# Altium schematic sheet MOTOR_DRIVER1.SchDoc
size A4
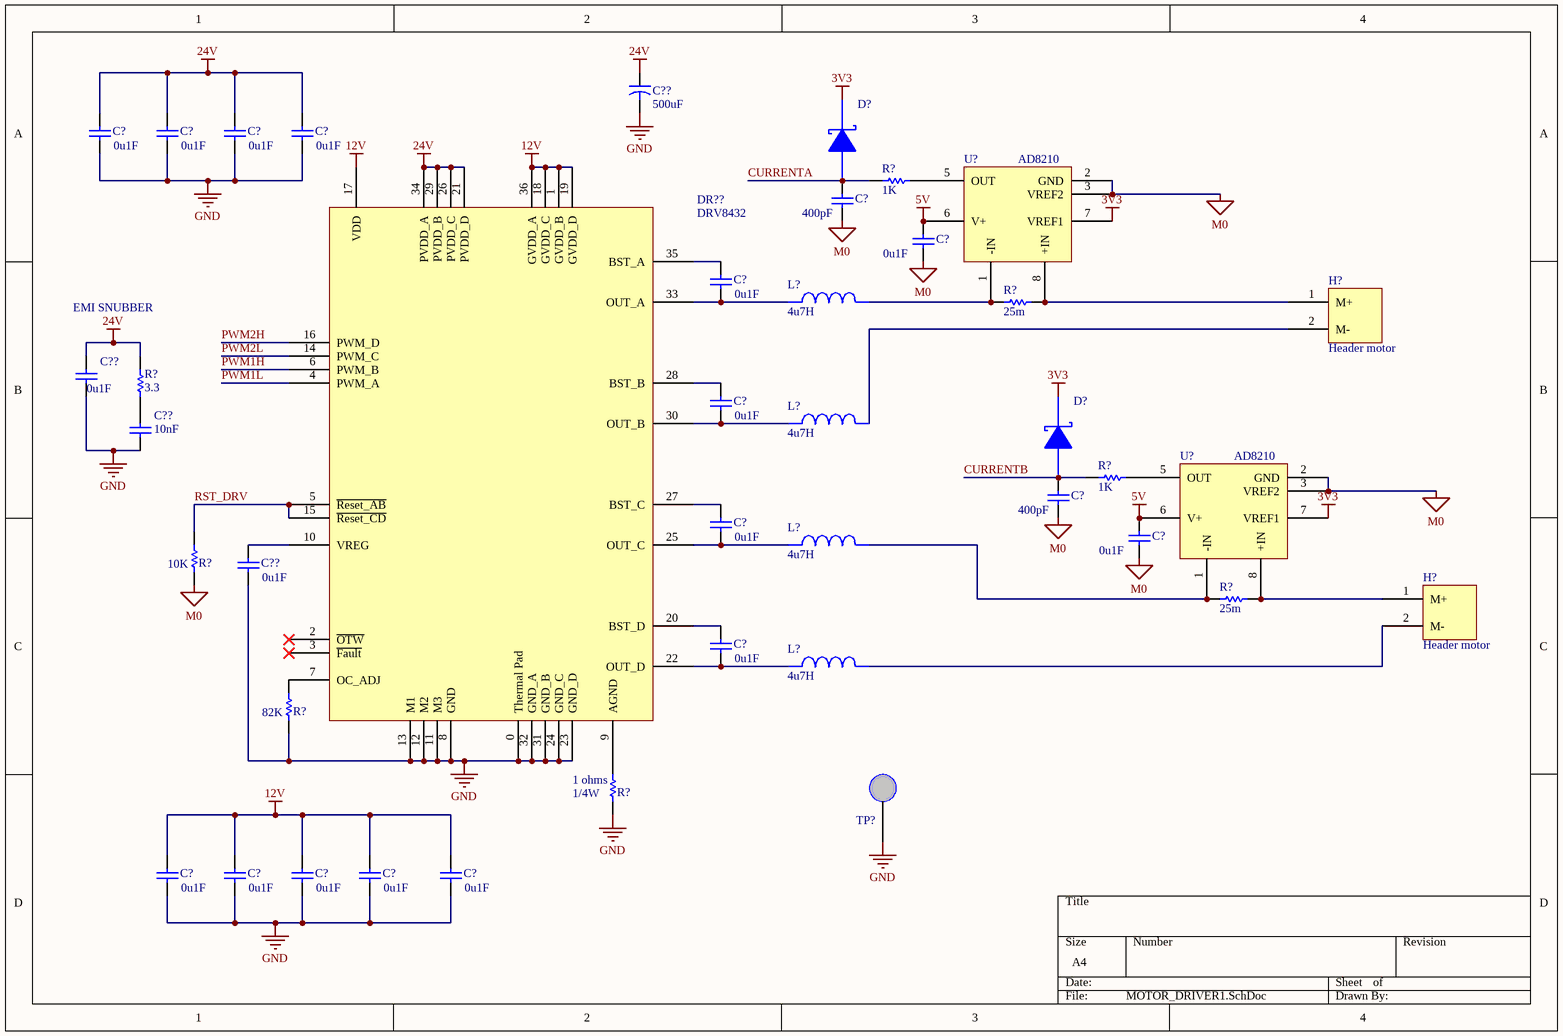
[diagram p0: MOTOR_DRIVER1.SchDoc]

## Parts
(Parts that share a designator on the sheet are numbered #1, #2 ... from top to bottom, then left to right.)
C?#1  value 0u1F  [0603]  (hidden comment: C0603)
C?#2  value 0u1F  [0603]  (hidden comment: C0603)
C?#3  value 0u1F  [0603]  (hidden comment: C0603)
C?#4  value 0u1F  [0603]  (hidden comment: C0603)
C?#5  value 400pF  [0603]  (hidden comment: C0603)
C?#6  value 0u1F  [0603]  (hidden comment: C0603)
C?#7  value 0u1F  [0603]  (hidden comment: C0603)
C?#8  value 0u1F  [0603]  (hidden comment: C0603)
C?#9  value 400pF  [0603]  (hidden comment: C0603)
C?#10  value 0u1F  [0603]  (hidden comment: C0603)
C?#11  value 0u1F  [0603]  (hidden comment: C0603)
C?#12  value 0u1F  [0603]  (hidden comment: C0603)
C?#13  value 0u1F  [0603]  (hidden comment: C0603)
C?#14  value 0u1F  [0603]  (hidden comment: C0603)
C?#15  value 0u1F  [0603]  (hidden comment: C0603)
C?#16  value 0u1F  [0603]  (hidden comment: C0603)
C?#17  value 0u1F  [0603]  (hidden comment: C0603)
C??#1  500uF
C??#2  value 0u1F  [C0805]  (hidden comment: C0805)
C??#3  value 10nF  [C0805]  (hidden comment: C0805)
C??#4  0u1F  [C0805]
D?#1  CRS08  (value not drawn)
D?#2  CRS08  (value not drawn)
DR??  DRV8432  [DRV8432]
H?#1  Header motor  [Header_motor_WEID]
H?#2  Header motor  [Header_motor_WEID]
L?#1  value 4u7H  (hidden comment: ChokeMotor)
L?#2  value 4u7H  (hidden comment: ChokeMotor)
L?#3  value 4u7H  (hidden comment: ChokeMotor)
L?#4  value 4u7H  (hidden comment: ChokeMotor)
R?#1  1K  [R0805]
R?#2  value 25m  [8RB-1206]  (hidden comment: 1206)
R?#3  value 3.3  [8RB-1206]  (hidden comment: 1206)
R?#4  1K  [R0805]
R?#5  10K  [R0805]
R?#6  value 25m  [8RB-1206]  (hidden comment: 1206)
R?#7  82K  [R0805]
R?#8  1 ohms  Power: 1/4W  [R0805]
TP?  5003K  [5003K]  (value not drawn)
U?#1  AD8210
U?#2  AD8210

## Nets
3V3: D?#1.2(A) D?#2.2(A) U?#1.7(VREF1) U?#2.7(VREF1)
5V: C?#6.2 C?#11.2 U?#1.6(V+) U?#2.6(V+)
12V: C?#13.2 C?#14.2 C?#15.2 C?#16.2 C?#17.2 DR??.1(GVDD_B) DR??.17(VDD) DR??.18(GVDD_C) DR??.19(GVDD_D) DR??.36(GVDD_A)
24V: C?#1.2 C?#2.2 C?#3.2 C?#4.2 C??#1.1 C??#2.2 DR??.21(PVDD_D) DR??.26(PVDD_C) DR??.29(PVDD_B) DR??.34(PVDD_A) R?#3.1
GND: C?#1.1 C?#2.1 C?#3.1 C?#4.1 C?#13.1 C?#14.1 C?#15.1 C?#16.1 C?#17.1 C??#1.2 C??#2.1 C??#3.1 C??#4.1 DR??.0(Thermal_Pad) DR??.8(GND) DR??.11(M3) DR??.12(M2) DR??.13(M1) DR??.23(GND_D) DR??.24(GND_C) DR??.31(GND_B) DR??.32(GND_A) R?#7.1 R?#8.1 TP?.1
M0: C?#5.1 C?#6.1 C?#9.1 C?#11.1 R?#5.1 U?#1.2(GND) U?#1.3(VREF2) U?#2.2(GND) U?#2.3(VREF2)
CURRENTA: C?#5.2 D?#1.1(K) R?#1.2
CURRENTB: C?#9.2 D?#2.1(K) R?#4.2
PWM1H: DR??.6(PWM_B)
PWM1L: DR??.4(PWM_A)
PWM2H: DR??.16(PWM_D)
PWM2L: DR??.14(PWM_C)
RST_DRV: DR??.5(~{Reset_AB}) DR??.15(~{Reset_CD}) R?#5.2
NetC?#7_1: C?#7.1 DR??.33(OUT_A) L?#1.2
NetC?#7_2: C?#7.2 DR??.35(BST_A)
NetC?#8_1: C?#8.1 DR??.30(OUT_B) L?#2.2
NetC?#8_2: C?#8.2 DR??.28(BST_B)
NetC?#10_1: C?#10.1 DR??.25(OUT_C) L?#3.2
NetC?#10_2: C?#10.2 DR??.27(BST_C)
NetC?#12_1: C?#12.1 DR??.22(OUT_D) L?#4.2
NetC?#12_2: C?#12.2 DR??.20(BST_D)
NetC??#3_2: C??#3.2 R?#3.2
NetC??#4_2: C??#4.2 DR??.10(VREG)
NetDR??_7: DR??.7(OC_ADJ) R?#7.2
NetDR??_9: DR??.9(AGND) R?#8.2
NetH?#1_1: H?#1.1(M+) R?#2.1 U?#1.8(+IN)
NetH?#1_2: H?#1.2(M-) L?#2.1
NetH?#2_1: H?#2.1(M+) R?#6.1 U?#2.8(+IN)
NetH?#2_2: H?#2.2(M-) L?#4.1
NetL?#1_1: L?#1.1 R?#2.2 U?#1.1(-IN)
NetL?#3_1: L?#3.1 R?#6.2 U?#2.1(-IN)
NetR?#1_1: R?#1.1 U?#1.5(OUT)
NetR?#4_1: R?#4.1 U?#2.5(OUT)

Not connected (* = marked no-connect by the designer): DR?? 2(~{OTW})* 3(~{Fault})*

## Notes on the sheet
- EMI SNUBBER

## Library data of the parts
C?#1-C?#17 = C0603: Ceramic Chip Capacitor - Standard; Note: Footprint corresponds to dimensions for bulk cassette packaging. This case size has tightened tolerances.; Published: 17-Jul-2002; LatestRevisionDate: 19-Mar-2004; LatestRevisionNote: Silkscreen size reduced.; DatasheetDocument: Mar-2001; PackageDocument: Mar-2001; PackageReference: 0603; Publisher: Altium Limited; Code_JEITA: 0603; Code_IPC: 1608 [0603]; ComponentLink1Description: Manufacturer Link; ComponentLink1URL: http://www.kemet.com/; ComponentLink2Description: Datasheet; ComponentLink2URL: http://www.kemet.com/kemet/web/homepage/kechome.nsf/vapubfilesname/F3102TA.pdf/$file/F3102TA.pdf
C??#1 = CAPDRV
C??#2 C??#3 = C0805: Ceramic Chip Capacitor - Standard; Note: Footprint corresponds to dimensions for bulk cassette packaging. This case size has tightened tolerances.; Published: 17-Jul-2002; LatestRevisionDate: 19-Mar-2004; LatestRevisionNote: Silkscreen size reduced.; DatasheetDocument: Mar-2001; PackageDocument: Mar-2001; PackageReference: 0805; Publisher: Altium Limited; Code_JEITA: 0805; Code_IPC: 2012[0805]; ComponentLink1Description: Manufacturer Link; ComponentLink1URL: http://www.kemet.com/; ComponentLink2Description: Datasheet; ComponentLink2URL: http://www.kemet.com/kemet/web/homepage/kechome.nsf/vapubfilesname/F3102TA.pdf/$file/F3102TA.pdf
C??#4 = C0805: Ceramic Chip Capacitor - Standard; Note: Footprint corresponds to dimensions for bulk cassette packaging. This case size has tightened tolerances.; Value: 100pF; Published: 17-Jul-2002; LatestRevisionDate: 19-Mar-2004; LatestRevisionNote: Silkscreen size reduced.; DatasheetDocument: Mar-2001; PackageDocument: Mar-2001; PackageReference: 0805; Publisher: Altium Limited; Code_JEITA: 0805; Code_IPC: 2012[0805]; ComponentLink1Description: Manufacturer Link; ComponentLink1URL: http://www.kemet.com/; ComponentLink2Description: Datasheet; ComponentLink2URL: http://www.kemet.com/kemet/web/homepage/kechome.nsf/vapubfilesname/F3102TA.pdf/$file/F3102TA.pdf
D?#1 D?#2 = Schottky current sense
DR?? = DRV8432: Dual Full Bridge PWM Motor Driver
H?#1 H?#2 = Header motor: Connecteurs moteur; Manufacturer number: LS 5.08/02/90 3.5SN OR BX
R?#1 R?#4 R?#5 R?#7 R?#8 = R0805: Resistor 0805
R?#2 R?#3 R?#6 = ERJ8RS: Low Ohmic Value Thick Film Chip Resistor, 0.1 Ohm to 0.2 Ohm Range, 1%, 2% and 5% Tolerance, 1206 Size, 0.25 W; Published: 17-Dec-2003; LatestRevisionDate: 19-Mar-2004; LatestRevisionNote: Silkscreen size reduced.; PackageDocument: Mar-2003; PackageReference: 8RB-1206; Publisher: Altium Limited; Code_IPC: 3216 [1206]; ComponentLink1Description: Manufacturer Link; ComponentLink1URL: http://www.panasonic.com/industrial/components/resistive_products.htm; ComponentLink2Description: Datasheet; ComponentLink2URL: http://www.panasonic.com/industrial/components/pdf/AOA0000CE3.pdf
TP? = Testpoint: Testpoint for power
U?#1 U?#2 = AD8210: Bidirectionnal curent sense amplifier